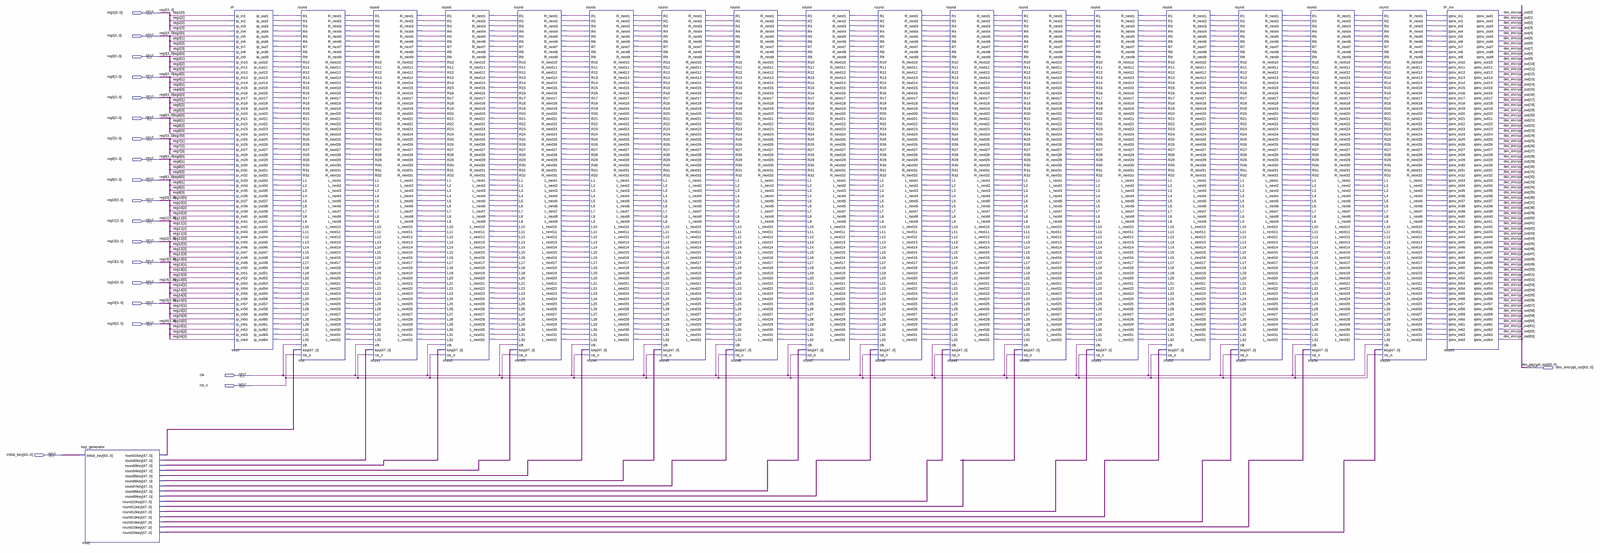
[diagram p0: schematic sheet, whole]
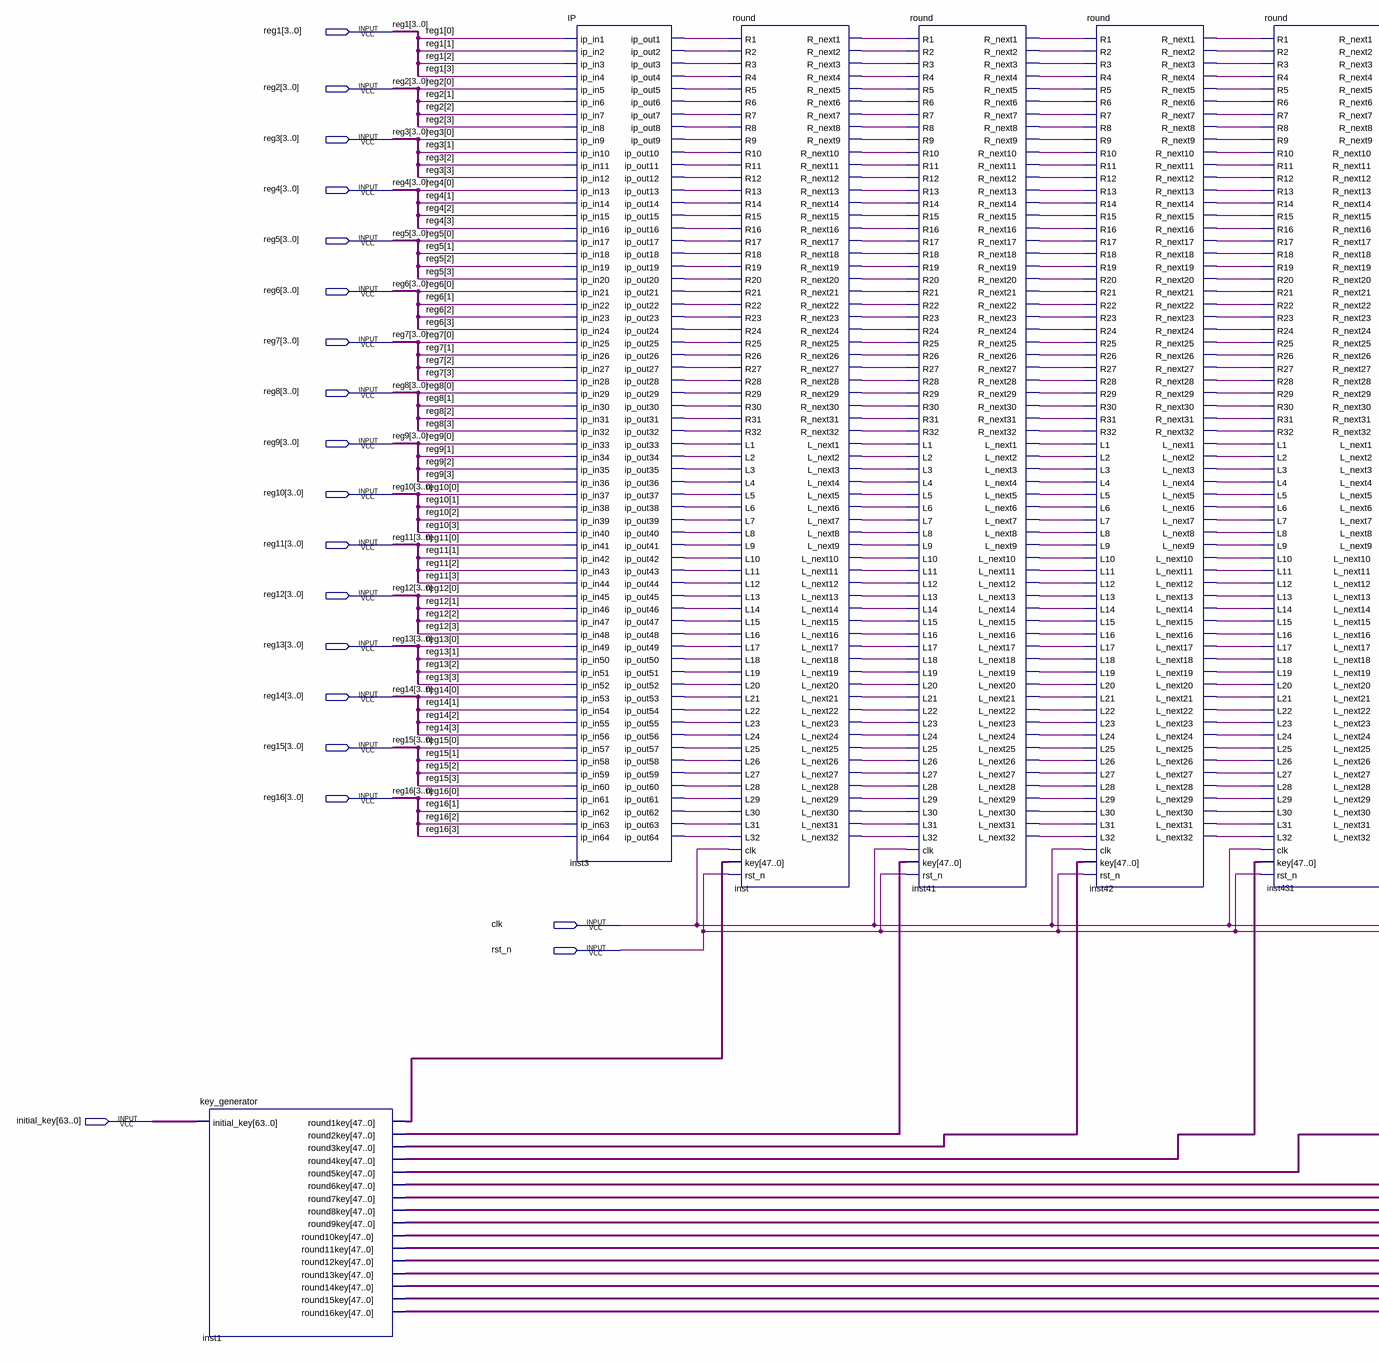
[diagram p1: schematic sheet, left part]
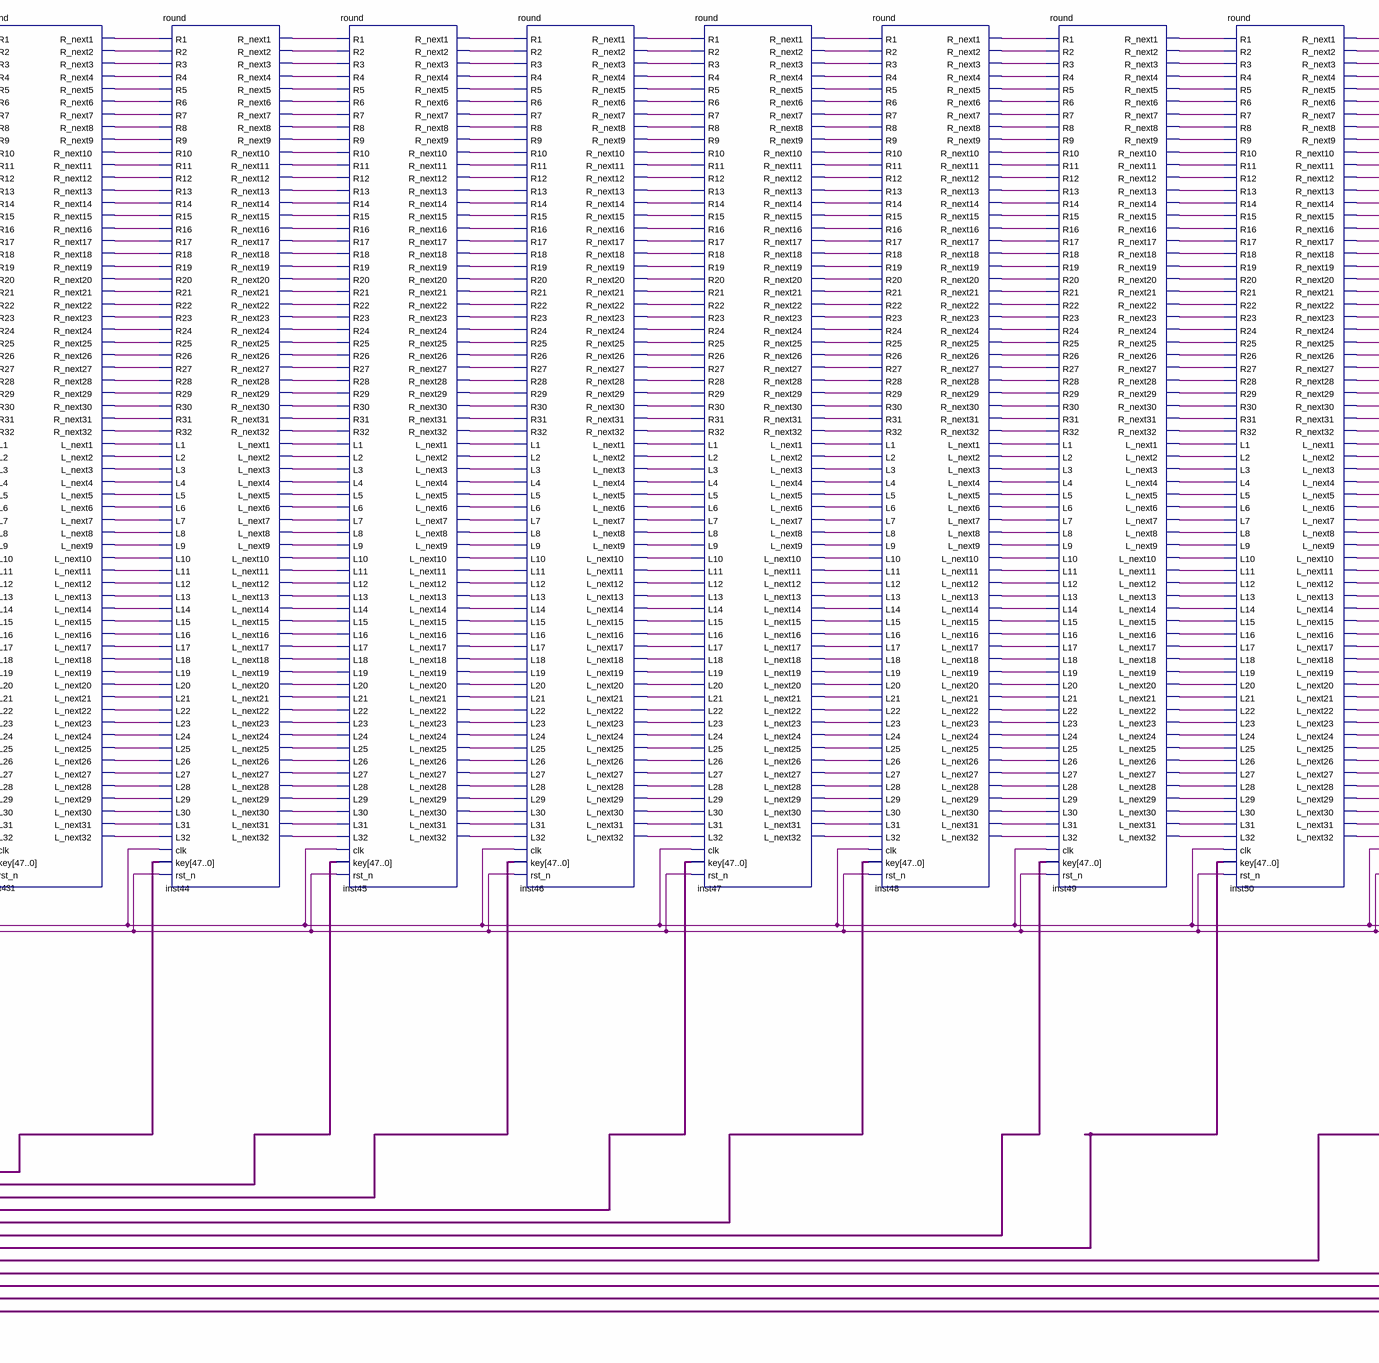
[diagram p2: schematic sheet, centre part]
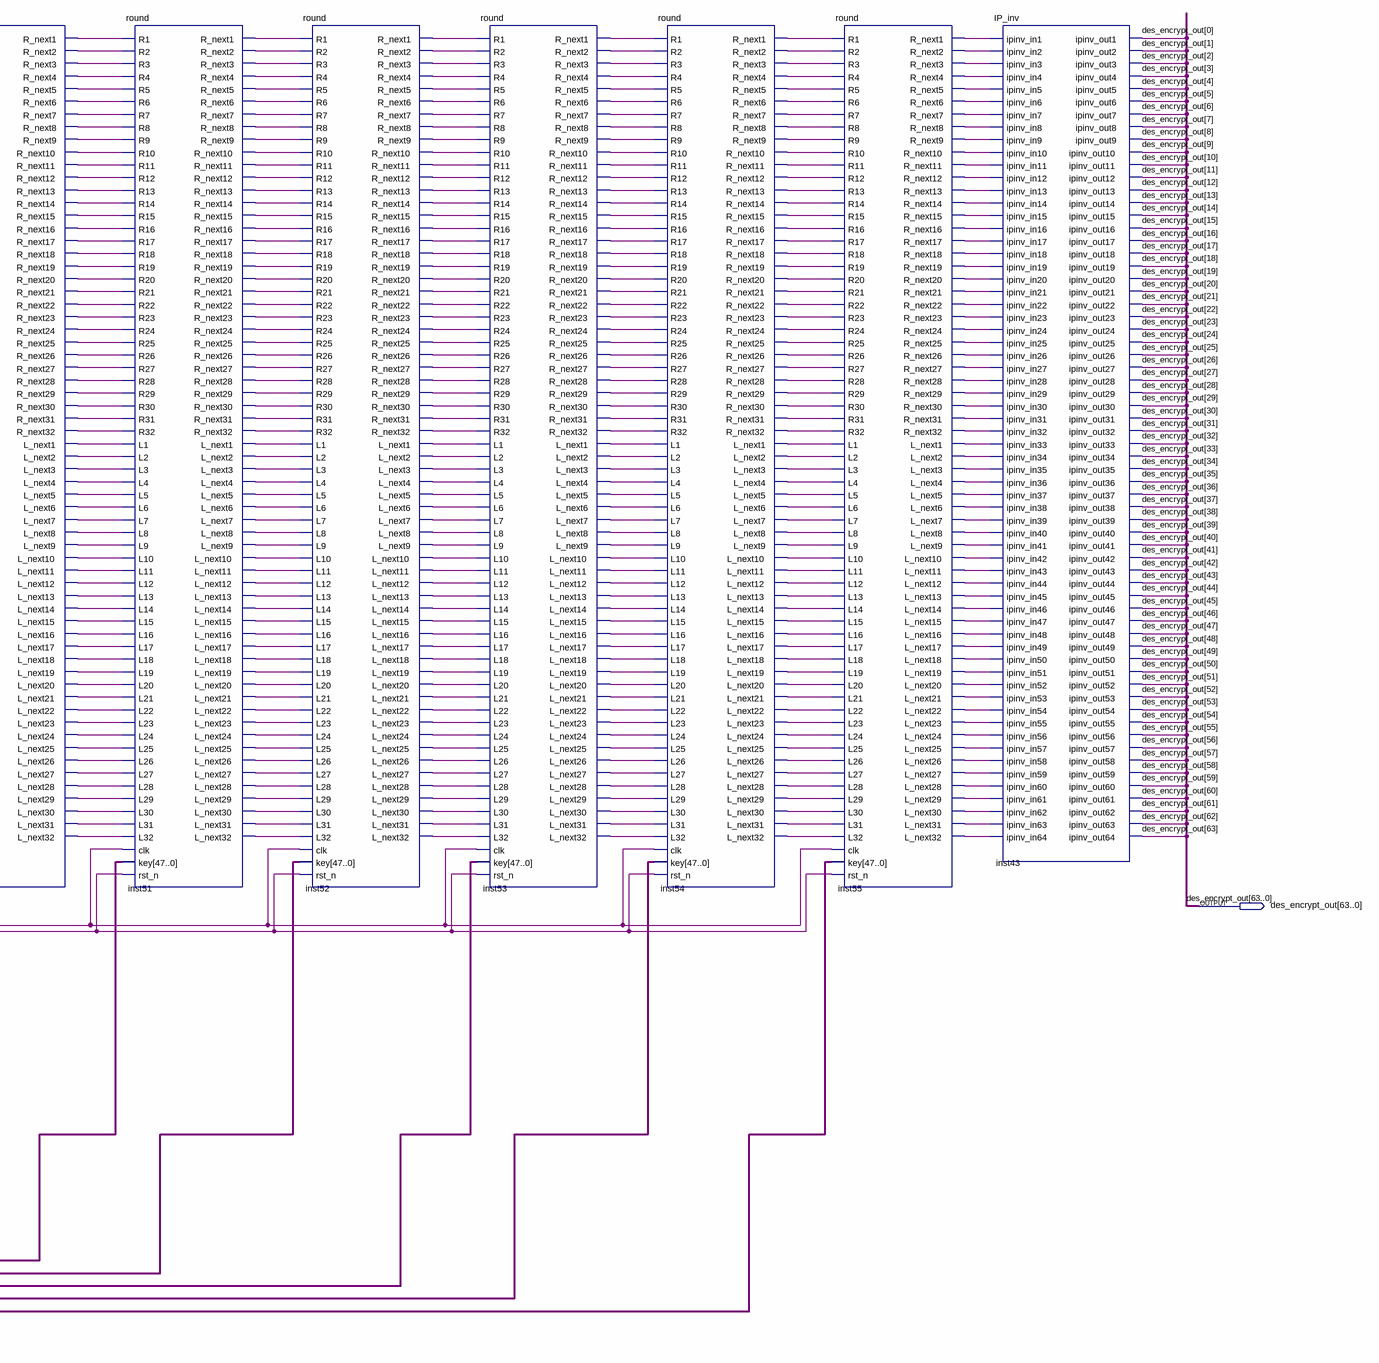
[diagram p3: schematic sheet, right part]
// Quartus schematic desencrypt.bdf as structural Verilog: 19 symbols, 20 pins
module desencrypt (
  input  [3:0] reg1,
  input  [3:0] reg2,
  input  [3:0] reg3,
  input  [3:0] reg4,
  input  [3:0] reg5,
  input  [3:0] reg6,
  input  [3:0] reg7,
  input  [3:0] reg8,
  input  [3:0] reg9,
  input  [3:0] reg10,
  input  [3:0] reg11,
  input  [3:0] reg12,
  input  [3:0] reg13,
  input  [3:0] reg14,
  input  [3:0] reg15,
  input  [3:0] reg16,
  input  clk,
  input  rst_n,
  input  [63:0] initial_key,
  output [63:0] des_encrypt_out
);

  wire inst3_ip_out1, inst3_ip_out2, inst3_ip_out3, inst3_ip_out4, inst3_ip_out5, inst3_ip_out6,
       inst3_ip_out7, inst3_ip_out8, inst3_ip_out9, inst3_ip_out10, inst3_ip_out11, inst3_ip_out12,
       inst3_ip_out13, inst3_ip_out14, inst3_ip_out15, inst3_ip_out16, inst3_ip_out17, inst3_ip_out18,
       inst3_ip_out19, inst3_ip_out20, inst3_ip_out21, inst3_ip_out22, inst3_ip_out23, inst3_ip_out24,
       inst3_ip_out25, inst3_ip_out26, inst3_ip_out27, inst3_ip_out28, inst3_ip_out29, inst3_ip_out30,
       inst3_ip_out31, inst3_ip_out32, inst3_ip_out33, inst3_ip_out34, inst3_ip_out35, inst3_ip_out36,
       inst3_ip_out37, inst3_ip_out38, inst3_ip_out39, inst3_ip_out40, inst3_ip_out41, inst3_ip_out42,
       inst3_ip_out43, inst3_ip_out44, inst3_ip_out45, inst3_ip_out46, inst3_ip_out47, inst3_ip_out48,
       inst3_ip_out49, inst3_ip_out50, inst3_ip_out51, inst3_ip_out52, inst3_ip_out53, inst3_ip_out54,
       inst3_ip_out55, inst3_ip_out56, inst3_ip_out57, inst3_ip_out58, inst3_ip_out59, inst3_ip_out60,
       inst3_ip_out61, inst3_ip_out62, inst3_ip_out63, inst3_ip_out64, inst41_l_next1, inst41_l_next2,
       inst41_l_next3, inst41_l_next4, inst41_l_next5, inst41_l_next6, inst41_l_next7, inst41_l_next8,
       inst41_l_next9, inst41_l_next10, inst41_l_next11, inst41_l_next12, inst41_l_next13, inst41_l_next14,
       inst41_l_next15, inst41_l_next16, inst41_l_next17, inst41_l_next18, inst41_l_next19, inst41_l_next20,
       inst41_l_next21, inst41_l_next22, inst41_l_next23, inst41_l_next24, inst41_l_next25, inst41_l_next26,
       inst41_l_next27, inst41_l_next28, inst41_l_next29, inst41_l_next30, inst41_l_next31, inst41_l_next32,
       inst41_r_next1, inst41_r_next2, inst41_r_next3, inst41_r_next4, inst41_r_next5, inst41_r_next6,
       inst41_r_next7, inst41_r_next8, inst41_r_next9, inst41_r_next10, inst41_r_next11, inst41_r_next12,
       inst41_r_next13, inst41_r_next14, inst41_r_next15, inst41_r_next16, inst41_r_next17, inst41_r_next18,
       inst41_r_next19, inst41_r_next20, inst41_r_next21, inst41_r_next22, inst41_r_next23, inst41_r_next24,
       inst41_r_next25, inst41_r_next26, inst41_r_next27, inst41_r_next28, inst41_r_next29, inst41_r_next30,
       inst41_r_next31, inst41_r_next32, inst42_l_next1, inst42_l_next2, inst42_l_next3, inst42_l_next4,
       inst42_l_next5, inst42_l_next6, inst42_l_next7, inst42_l_next8, inst42_l_next9, inst42_l_next10,
       inst42_l_next11, inst42_l_next12, inst42_l_next13, inst42_l_next14, inst42_l_next15, inst42_l_next16,
       inst42_l_next17, inst42_l_next18, inst42_l_next19, inst42_l_next20, inst42_l_next21, inst42_l_next22,
       inst42_l_next23, inst42_l_next24, inst42_l_next25, inst42_l_next26, inst42_l_next27, inst42_l_next28,
       inst42_l_next29, inst42_l_next30, inst42_l_next31, inst42_l_next32, inst42_r_next1, inst42_r_next2,
       inst42_r_next3, inst42_r_next4, inst42_r_next5, inst42_r_next6, inst42_r_next7, inst42_r_next8,
       inst42_r_next9, inst42_r_next10, inst42_r_next11, inst42_r_next12, inst42_r_next13, inst42_r_next14,
       inst42_r_next15, inst42_r_next16, inst42_r_next17, inst42_r_next18, inst42_r_next19, inst42_r_next20,
       inst42_r_next21, inst42_r_next22, inst42_r_next23, inst42_r_next24, inst42_r_next25, inst42_r_next26,
       inst42_r_next27, inst42_r_next28, inst42_r_next29, inst42_r_next30, inst42_r_next31, inst42_r_next32,
       inst44_l_next1, inst44_l_next2, inst44_l_next3, inst44_l_next4, inst44_l_next5, inst44_l_next6,
       inst44_l_next7, inst44_l_next8, inst44_l_next9, inst44_l_next10, inst44_l_next11, inst44_l_next12,
       inst44_l_next13, inst44_l_next14, inst44_l_next15, inst44_l_next16, inst44_l_next17, inst44_l_next18,
       inst44_l_next19, inst44_l_next20, inst44_l_next21, inst44_l_next22, inst44_l_next23, inst44_l_next24,
       inst44_l_next25, inst44_l_next26, inst44_l_next27, inst44_l_next28, inst44_l_next29, inst44_l_next30,
       inst44_l_next31, inst44_l_next32, inst44_r_next1, inst44_r_next2, inst44_r_next3, inst44_r_next4,
       inst44_r_next5, inst44_r_next6, inst44_r_next7, inst44_r_next8, inst44_r_next9, inst44_r_next10,
       inst44_r_next11, inst44_r_next12, inst44_r_next13, inst44_r_next14, inst44_r_next15, inst44_r_next16,
       inst44_r_next17, inst44_r_next18, inst44_r_next19, inst44_r_next20, inst44_r_next21, inst44_r_next22,
       inst44_r_next23, inst44_r_next24, inst44_r_next25, inst44_r_next26, inst44_r_next27, inst44_r_next28,
       inst44_r_next29, inst44_r_next30, inst44_r_next31, inst44_r_next32, inst45_l_next1, inst45_l_next2,
       inst45_l_next3, inst45_l_next4, inst45_l_next5, inst45_l_next6, inst45_l_next7, inst45_l_next8,
       inst45_l_next9, inst45_l_next10, inst45_l_next11, inst45_l_next12, inst45_l_next13, inst45_l_next14,
       inst45_l_next15, inst45_l_next16, inst45_l_next17, inst45_l_next18, inst45_l_next19, inst45_l_next20,
       inst45_l_next21, inst45_l_next22, inst45_l_next23, inst45_l_next24, inst45_l_next25, inst45_l_next26,
       inst45_l_next27, inst45_l_next28, inst45_l_next29, inst45_l_next30, inst45_l_next31, inst45_l_next32,
       inst45_r_next1, inst45_r_next2, inst45_r_next3, inst45_r_next4, inst45_r_next5, inst45_r_next6,
       inst45_r_next7, inst45_r_next8, inst45_r_next9, inst45_r_next10, inst45_r_next11, inst45_r_next12,
       inst45_r_next13, inst45_r_next14, inst45_r_next15, inst45_r_next16, inst45_r_next17, inst45_r_next18,
       inst45_r_next19, inst45_r_next20, inst45_r_next21, inst45_r_next22, inst45_r_next23, inst45_r_next24,
       inst45_r_next25, inst45_r_next26, inst45_r_next27, inst45_r_next28, inst45_r_next29, inst45_r_next30,
       inst45_r_next31, inst45_r_next32, inst46_l_next1, inst46_l_next2, inst46_l_next3, inst46_l_next4,
       inst46_l_next5, inst46_l_next6, inst46_l_next7, inst46_l_next8, inst46_l_next9, inst46_l_next10,
       inst46_l_next11, inst46_l_next12, inst46_l_next13, inst46_l_next14, inst46_l_next15, inst46_l_next16,
       inst46_l_next17, inst46_l_next18, inst46_l_next19, inst46_l_next20, inst46_l_next21, inst46_l_next22,
       inst46_l_next23, inst46_l_next24, inst46_l_next25, inst46_l_next26, inst46_l_next27, inst46_l_next28,
       inst46_l_next29, inst46_l_next30, inst46_l_next31, inst46_l_next32, inst46_r_next1, inst46_r_next2,
       inst46_r_next3, inst46_r_next4, inst46_r_next5, inst46_r_next6, inst46_r_next7, inst46_r_next8,
       inst46_r_next9, inst46_r_next10, inst46_r_next11, inst46_r_next12, inst46_r_next13, inst46_r_next14,
       inst46_r_next15, inst46_r_next16, inst46_r_next17, inst46_r_next18, inst46_r_next19, inst46_r_next20,
       inst46_r_next21, inst46_r_next22, inst46_r_next23, inst46_r_next24, inst46_r_next25, inst46_r_next26,
       inst46_r_next27, inst46_r_next28, inst46_r_next29, inst46_r_next30, inst46_r_next31, inst46_r_next32,
       inst47_l_next1, inst47_l_next2, inst47_l_next3, inst47_l_next4, inst47_l_next5, inst47_l_next6,
       inst47_l_next7, inst47_l_next8, inst47_l_next9, inst47_l_next10, inst47_l_next11, inst47_l_next12,
       inst47_l_next13, inst47_l_next14, inst47_l_next15, inst47_l_next16, inst47_l_next17, inst47_l_next18,
       inst47_l_next19, inst47_l_next20, inst47_l_next21, inst47_l_next22, inst47_l_next23, inst47_l_next24,
       inst47_l_next25, inst47_l_next26, inst47_l_next27, inst47_l_next28, inst47_l_next29, inst47_l_next30,
       inst47_l_next31, inst47_l_next32, inst47_r_next1, inst47_r_next2, inst47_r_next3, inst47_r_next4,
       inst47_r_next5, inst47_r_next6, inst47_r_next7, inst47_r_next8, inst47_r_next9, inst47_r_next10,
       inst47_r_next11, inst47_r_next12, inst47_r_next13, inst47_r_next14, inst47_r_next15, inst47_r_next16,
       inst47_r_next17, inst47_r_next18, inst47_r_next19, inst47_r_next20, inst47_r_next21, inst47_r_next22,
       inst47_r_next23, inst47_r_next24, inst47_r_next25, inst47_r_next26, inst47_r_next27, inst47_r_next28,
       inst47_r_next29, inst47_r_next30, inst47_r_next31, inst47_r_next32, inst48_l_next1, inst48_l_next2,
       inst48_l_next3, inst48_l_next4, inst48_l_next5, inst48_l_next6, inst48_l_next7, inst48_l_next8,
       inst48_l_next9, inst48_l_next10, inst48_l_next11, inst48_l_next12, inst48_l_next13, inst48_l_next14,
       inst48_l_next15, inst48_l_next16, inst48_l_next17, inst48_l_next18, inst48_l_next19, inst48_l_next20,
       inst48_l_next21, inst48_l_next22, inst48_l_next23, inst48_l_next24, inst48_l_next25, inst48_l_next26,
       inst48_l_next27, inst48_l_next28, inst48_l_next29, inst48_l_next30, inst48_l_next31, inst48_l_next32,
       inst48_r_next1, inst48_r_next2, inst48_r_next3, inst48_r_next4, inst48_r_next5, inst48_r_next6,
       inst48_r_next7, inst48_r_next8, inst48_r_next9, inst48_r_next10, inst48_r_next11, inst48_r_next12,
       inst48_r_next13, inst48_r_next14, inst48_r_next15, inst48_r_next16, inst48_r_next17, inst48_r_next18,
       inst48_r_next19, inst48_r_next20, inst48_r_next21, inst48_r_next22, inst48_r_next23, inst48_r_next24,
       inst48_r_next25, inst48_r_next26, inst48_r_next27, inst48_r_next28, inst48_r_next29, inst48_r_next30,
       inst48_r_next31, inst48_r_next32, inst49_l_next1, inst49_l_next2, inst49_l_next3, inst49_l_next4,
       inst49_l_next5, inst49_l_next6, inst49_l_next7, inst49_l_next8, inst49_l_next9, inst49_l_next10,
       inst49_l_next11, inst49_l_next12, inst49_l_next13, inst49_l_next14, inst49_l_next15, inst49_l_next16,
       inst49_l_next17, inst49_l_next18, inst49_l_next19, inst49_l_next20, inst49_l_next21, inst49_l_next22,
       inst49_l_next23, inst49_l_next24, inst49_l_next25, inst49_l_next26, inst49_l_next27, inst49_l_next28,
       inst49_l_next29, inst49_l_next30, inst49_l_next31, inst49_l_next32, inst49_r_next1, inst49_r_next2,
       inst49_r_next3, inst49_r_next4, inst49_r_next5, inst49_r_next6, inst49_r_next7, inst49_r_next8,
       inst49_r_next9, inst49_r_next10, inst49_r_next11, inst49_r_next12, inst49_r_next13, inst49_r_next14,
       inst49_r_next15, inst49_r_next16, inst49_r_next17, inst49_r_next18, inst49_r_next19, inst49_r_next20,
       inst49_r_next21, inst49_r_next22, inst49_r_next23, inst49_r_next24, inst49_r_next25, inst49_r_next26,
       inst49_r_next27, inst49_r_next28, inst49_r_next29, inst49_r_next30, inst49_r_next31, inst49_r_next32,
       inst50_l_next1, inst50_l_next2, inst50_l_next3, inst50_l_next4, inst50_l_next5, inst50_l_next6,
       inst50_l_next7, inst50_l_next8, inst50_l_next9, inst50_l_next10, inst50_l_next11, inst50_l_next12,
       inst50_l_next13, inst50_l_next14, inst50_l_next15, inst50_l_next16, inst50_l_next17, inst50_l_next18,
       inst50_l_next19, inst50_l_next20, inst50_l_next21, inst50_l_next22, inst50_l_next23, inst50_l_next24,
       inst50_l_next25, inst50_l_next26, inst50_l_next27, inst50_l_next28, inst50_l_next29, inst50_l_next30,
       inst50_l_next31, inst50_l_next32, inst50_r_next1, inst50_r_next2, inst50_r_next3, inst50_r_next4,
       inst50_r_next5, inst50_r_next6, inst50_r_next7, inst50_r_next8, inst50_r_next9, inst50_r_next10,
       inst50_r_next11, inst50_r_next12, inst50_r_next13, inst50_r_next14, inst50_r_next15, inst50_r_next16,
       inst50_r_next17, inst50_r_next18, inst50_r_next19, inst50_r_next20, inst50_r_next21, inst50_r_next22,
       inst50_r_next23, inst50_r_next24, inst50_r_next25, inst50_r_next26, inst50_r_next27, inst50_r_next28,
       inst50_r_next29, inst50_r_next30, inst50_r_next31, inst50_r_next32, inst51_l_next1, inst51_l_next2,
       inst51_l_next3, inst51_l_next4, inst51_l_next5, inst51_l_next6, inst51_l_next7, inst51_l_next8,
       inst51_l_next9, inst51_l_next10, inst51_l_next11, inst51_l_next12, inst51_l_next13, inst51_l_next14,
       inst51_l_next15, inst51_l_next16, inst51_l_next17, inst51_l_next18, inst51_l_next19, inst51_l_next20,
       inst51_l_next21, inst51_l_next22, inst51_l_next23, inst51_l_next24, inst51_l_next25, inst51_l_next26,
       inst51_l_next27, inst51_l_next28, inst51_l_next29, inst51_l_next30, inst51_l_next31, inst51_l_next32,
       inst51_r_next1, inst51_r_next2, inst51_r_next3, inst51_r_next4, inst51_r_next5, inst51_r_next6,
       inst51_r_next7, inst51_r_next8, inst51_r_next9, inst51_r_next10, inst51_r_next11, inst51_r_next12,
       inst51_r_next13, inst51_r_next14, inst51_r_next15, inst51_r_next16, inst51_r_next17, inst51_r_next18,
       inst51_r_next19, inst51_r_next20, inst51_r_next21, inst51_r_next22, inst51_r_next23, inst51_r_next24,
       inst51_r_next25, inst51_r_next26, inst51_r_next27, inst51_r_next28, inst51_r_next29, inst51_r_next30,
       inst51_r_next31, inst51_r_next32, inst52_l_next1, inst52_l_next2, inst52_l_next3, inst52_l_next4,
       inst52_l_next5, inst52_l_next6, inst52_l_next7, inst52_l_next8, inst52_l_next9, inst52_l_next10,
       inst52_l_next11, inst52_l_next12, inst52_l_next13, inst52_l_next14, inst52_l_next15, inst52_l_next16,
       inst52_l_next17, inst52_l_next18, inst52_l_next19, inst52_l_next20, inst52_l_next21, inst52_l_next22,
       inst52_l_next23, inst52_l_next24, inst52_l_next25, inst52_l_next26, inst52_l_next27, inst52_l_next28,
       inst52_l_next29, inst52_l_next30, inst52_l_next31, inst52_l_next32, inst52_r_next1, inst52_r_next2,
       inst52_r_next3, inst52_r_next4, inst52_r_next5, inst52_r_next6, inst52_r_next7, inst52_r_next8,
       inst52_r_next9, inst52_r_next10, inst52_r_next11, inst52_r_next12, inst52_r_next13, inst52_r_next14,
       inst52_r_next15, inst52_r_next16, inst52_r_next17, inst52_r_next18, inst52_r_next19, inst52_r_next20,
       inst52_r_next21, inst52_r_next22, inst52_r_next23, inst52_r_next24, inst52_r_next25, inst52_r_next26,
       inst52_r_next27, inst52_r_next28, inst52_r_next29, inst52_r_next30, inst52_r_next31, inst52_r_next32,
       inst53_l_next1, inst53_l_next2, inst53_l_next3, inst53_l_next4, inst53_l_next5, inst53_l_next6,
       inst53_l_next7, inst53_l_next8, inst53_l_next9, inst53_l_next10, inst53_l_next11, inst53_l_next12,
       inst53_l_next13, inst53_l_next14, inst53_l_next15, inst53_l_next16, inst53_l_next17, inst53_l_next18,
       inst53_l_next19, inst53_l_next20, inst53_l_next21, inst53_l_next22, inst53_l_next23, inst53_l_next24,
       inst53_l_next25, inst53_l_next26, inst53_l_next27, inst53_l_next28, inst53_l_next29, inst53_l_next30,
       inst53_l_next31, inst53_l_next32, inst53_r_next1, inst53_r_next2, inst53_r_next3, inst53_r_next4,
       inst53_r_next5, inst53_r_next6, inst53_r_next7, inst53_r_next8, inst53_r_next9, inst53_r_next10,
       inst53_r_next11, inst53_r_next12, inst53_r_next13, inst53_r_next14, inst53_r_next15, inst53_r_next16,
       inst53_r_next17, inst53_r_next18, inst53_r_next19, inst53_r_next20, inst53_r_next21, inst53_r_next22,
       inst53_r_next23, inst53_r_next24, inst53_r_next25, inst53_r_next26, inst53_r_next27, inst53_r_next28,
       inst53_r_next29, inst53_r_next30, inst53_r_next31, inst53_r_next32, inst54_l_next1, inst54_l_next2,
       inst54_l_next3, inst54_l_next4, inst54_l_next5, inst54_l_next6, inst54_l_next7, inst54_l_next8,
       inst54_l_next9, inst54_l_next10, inst54_l_next11, inst54_l_next12, inst54_l_next13, inst54_l_next14,
       inst54_l_next15, inst54_l_next16, inst54_l_next17, inst54_l_next18, inst54_l_next19, inst54_l_next20,
       inst54_l_next21, inst54_l_next22, inst54_l_next23, inst54_l_next24, inst54_l_next25, inst54_l_next26,
       inst54_l_next27, inst54_l_next28, inst54_l_next29, inst54_l_next30, inst54_l_next31, inst54_l_next32,
       inst54_r_next1, inst54_r_next2, inst54_r_next3, inst54_r_next4, inst54_r_next5, inst54_r_next6,
       inst54_r_next7, inst54_r_next8, inst54_r_next9, inst54_r_next10, inst54_r_next11, inst54_r_next12,
       inst54_r_next13, inst54_r_next14, inst54_r_next15, inst54_r_next16, inst54_r_next17, inst54_r_next18,
       inst54_r_next19, inst54_r_next20, inst54_r_next21, inst54_r_next22, inst54_r_next23, inst54_r_next24,
       inst54_r_next25, inst54_r_next26, inst54_r_next27, inst54_r_next28, inst54_r_next29, inst54_r_next30,
       inst54_r_next31, inst54_r_next32, inst55_l_next1, inst55_l_next2, inst55_l_next3, inst55_l_next4,
       inst55_l_next5, inst55_l_next6, inst55_l_next7, inst55_l_next8, inst55_l_next9, inst55_l_next10,
       inst55_l_next11, inst55_l_next12, inst55_l_next13, inst55_l_next14, inst55_l_next15, inst55_l_next16,
       inst55_l_next17, inst55_l_next18, inst55_l_next19, inst55_l_next20, inst55_l_next21, inst55_l_next22,
       inst55_l_next23, inst55_l_next24, inst55_l_next25, inst55_l_next26, inst55_l_next27, inst55_l_next28,
       inst55_l_next29, inst55_l_next30, inst55_l_next31, inst55_l_next32, inst55_r_next1, inst55_r_next2,
       inst55_r_next3, inst55_r_next4, inst55_r_next5, inst55_r_next6, inst55_r_next7, inst55_r_next8,
       inst55_r_next9, inst55_r_next10, inst55_r_next11, inst55_r_next12, inst55_r_next13, inst55_r_next14,
       inst55_r_next15, inst55_r_next16, inst55_r_next17, inst55_r_next18, inst55_r_next19, inst55_r_next20,
       inst55_r_next21, inst55_r_next22, inst55_r_next23, inst55_r_next24, inst55_r_next25, inst55_r_next26,
       inst55_r_next27, inst55_r_next28, inst55_r_next29, inst55_r_next30, inst55_r_next31, inst55_r_next32,
       inst431_l_next1, inst431_l_next2, inst431_l_next3, inst431_l_next4, inst431_l_next5, inst431_l_next6,
       inst431_l_next7, inst431_l_next8, inst431_l_next9, inst431_l_next10, inst431_l_next11,
       inst431_l_next12, inst431_l_next13, inst431_l_next14, inst431_l_next15, inst431_l_next16,
       inst431_l_next17, inst431_l_next18, inst431_l_next19, inst431_l_next20, inst431_l_next21,
       inst431_l_next22, inst431_l_next23, inst431_l_next24, inst431_l_next25, inst431_l_next26,
       inst431_l_next27, inst431_l_next28, inst431_l_next29, inst431_l_next30, inst431_l_next31,
       inst431_l_next32, inst431_r_next1, inst431_r_next2, inst431_r_next3, inst431_r_next4, inst431_r_next5,
       inst431_r_next6, inst431_r_next7, inst431_r_next8, inst431_r_next9, inst431_r_next10,
       inst431_r_next11, inst431_r_next12, inst431_r_next13, inst431_r_next14, inst431_r_next15,
       inst431_r_next16, inst431_r_next17, inst431_r_next18, inst431_r_next19, inst431_r_next20,
       inst431_r_next21, inst431_r_next22, inst431_r_next23, inst431_r_next24, inst431_r_next25,
       inst431_r_next26, inst431_r_next27, inst431_r_next28, inst431_r_next29, inst431_r_next30,
       inst431_r_next31, inst431_r_next32, inst_l_next1, inst_l_next2, inst_l_next3, inst_l_next4,
       inst_l_next5, inst_l_next6, inst_l_next7, inst_l_next8, inst_l_next9, inst_l_next10, inst_l_next11,
       inst_l_next12, inst_l_next13, inst_l_next14, inst_l_next15, inst_l_next16, inst_l_next17,
       inst_l_next18, inst_l_next19, inst_l_next20, inst_l_next21, inst_l_next22, inst_l_next23,
       inst_l_next24, inst_l_next25, inst_l_next26, inst_l_next27, inst_l_next28, inst_l_next29,
       inst_l_next30, inst_l_next31, inst_l_next32, inst_r_next1, inst_r_next2, inst_r_next3, inst_r_next4,
       inst_r_next5, inst_r_next6, inst_r_next7, inst_r_next8, inst_r_next9, inst_r_next10, inst_r_next11,
       inst_r_next12, inst_r_next13, inst_r_next14, inst_r_next15, inst_r_next16, inst_r_next17,
       inst_r_next18, inst_r_next19, inst_r_next20, inst_r_next21, inst_r_next22, inst_r_next23,
       inst_r_next24, inst_r_next25, inst_r_next26, inst_r_next27, inst_r_next28, inst_r_next29,
       inst_r_next30, inst_r_next31, inst_r_next32;
  wire [47:0] inst1_round1key, inst1_round2key, inst1_round3key, inst1_round4key, inst1_round5key,
       inst1_round6key, inst1_round7key, inst1_round8key, inst1_round9key, inst1_round10key,
       inst1_round11key, inst1_round12key, inst1_round13key, inst1_round14key, inst1_round15key,
       inst1_round16key;

  key_generator inst1 (
    .initial_key(initial_key), .round1key(inst1_round1key), .round2key(inst1_round2key),
    .round3key(inst1_round3key), .round4key(inst1_round4key), .round5key(inst1_round5key),
    .round6key(inst1_round6key), .round7key(inst1_round7key), .round8key(inst1_round8key),
    .round9key(inst1_round9key), .round10key(inst1_round10key), .round11key(inst1_round11key),
    .round12key(inst1_round12key), .round13key(inst1_round13key), .round14key(inst1_round14key),
    .round15key(inst1_round15key), .round16key(inst1_round16key));
  IP inst3 (
    .ip_in1(reg1[0]), .ip_in2(reg1[1]), .ip_in3(reg1[2]), .ip_in4(reg1[3]), .ip_in5(reg2[0]),
    .ip_in6(reg2[1]), .ip_in7(reg2[2]), .ip_in8(reg2[3]), .ip_in9(reg3[0]), .ip_in10(reg3[1]),
    .ip_in11(reg3[2]), .ip_in12(reg3[3]), .ip_in13(reg4[0]), .ip_in14(reg4[1]), .ip_in15(reg4[2]),
    .ip_in16(reg4[3]), .ip_in17(reg5[0]), .ip_in18(reg5[1]), .ip_in19(reg5[2]), .ip_in20(reg5[3]),
    .ip_in21(reg6[0]), .ip_in22(reg6[1]), .ip_in23(reg6[2]), .ip_in24(reg6[3]), .ip_in25(reg7[0]),
    .ip_in26(reg7[1]), .ip_in27(reg7[2]), .ip_in28(reg7[3]), .ip_in29(reg8[0]), .ip_in30(reg8[1]),
    .ip_in31(reg8[2]), .ip_in32(reg8[3]), .ip_in33(reg9[0]), .ip_in34(reg9[1]), .ip_in35(reg9[2]),
    .ip_in36(reg9[3]), .ip_in37(reg10[0]), .ip_in38(reg10[1]), .ip_in39(reg10[2]), .ip_in40(reg10[3]),
    .ip_in41(reg11[0]), .ip_in42(reg11[1]), .ip_in43(reg11[2]), .ip_in44(reg11[3]), .ip_in45(reg12[0]),
    .ip_in46(reg12[1]), .ip_in47(reg12[2]), .ip_in48(reg12[3]), .ip_in49(reg13[0]), .ip_in50(reg13[1]),
    .ip_in51(reg13[2]), .ip_in52(reg13[3]), .ip_in53(reg14[0]), .ip_in54(reg14[1]), .ip_in55(reg14[2]),
    .ip_in56(reg14[3]), .ip_in57(reg15[0]), .ip_in58(reg15[1]), .ip_in59(reg15[2]), .ip_in60(reg15[3]),
    .ip_in61(reg16[0]), .ip_in62(reg16[1]), .ip_in63(reg16[2]), .ip_in64(reg16[3]), .ip_out1(inst3_ip_out1),
    .ip_out2(inst3_ip_out2), .ip_out3(inst3_ip_out3), .ip_out4(inst3_ip_out4), .ip_out5(inst3_ip_out5),
    .ip_out6(inst3_ip_out6), .ip_out7(inst3_ip_out7), .ip_out8(inst3_ip_out8), .ip_out9(inst3_ip_out9),
    .ip_out10(inst3_ip_out10), .ip_out11(inst3_ip_out11), .ip_out12(inst3_ip_out12),
    .ip_out13(inst3_ip_out13), .ip_out14(inst3_ip_out14), .ip_out15(inst3_ip_out15),
    .ip_out16(inst3_ip_out16), .ip_out17(inst3_ip_out17), .ip_out18(inst3_ip_out18),
    .ip_out19(inst3_ip_out19), .ip_out20(inst3_ip_out20), .ip_out21(inst3_ip_out21),
    .ip_out22(inst3_ip_out22), .ip_out23(inst3_ip_out23), .ip_out24(inst3_ip_out24),
    .ip_out25(inst3_ip_out25), .ip_out26(inst3_ip_out26), .ip_out27(inst3_ip_out27),
    .ip_out28(inst3_ip_out28), .ip_out29(inst3_ip_out29), .ip_out30(inst3_ip_out30),
    .ip_out31(inst3_ip_out31), .ip_out32(inst3_ip_out32), .ip_out33(inst3_ip_out33),
    .ip_out34(inst3_ip_out34), .ip_out35(inst3_ip_out35), .ip_out36(inst3_ip_out36),
    .ip_out37(inst3_ip_out37), .ip_out38(inst3_ip_out38), .ip_out39(inst3_ip_out39),
    .ip_out40(inst3_ip_out40), .ip_out41(inst3_ip_out41), .ip_out42(inst3_ip_out42),
    .ip_out43(inst3_ip_out43), .ip_out44(inst3_ip_out44), .ip_out45(inst3_ip_out45),
    .ip_out46(inst3_ip_out46), .ip_out47(inst3_ip_out47), .ip_out48(inst3_ip_out48),
    .ip_out49(inst3_ip_out49), .ip_out50(inst3_ip_out50), .ip_out51(inst3_ip_out51),
    .ip_out52(inst3_ip_out52), .ip_out53(inst3_ip_out53), .ip_out54(inst3_ip_out54),
    .ip_out55(inst3_ip_out55), .ip_out56(inst3_ip_out56), .ip_out57(inst3_ip_out57),
    .ip_out58(inst3_ip_out58), .ip_out59(inst3_ip_out59), .ip_out60(inst3_ip_out60),
    .ip_out61(inst3_ip_out61), .ip_out62(inst3_ip_out62), .ip_out63(inst3_ip_out63), .ip_out64(inst3_ip_out64));
  round inst (
    .R1(inst3_ip_out1), .R2(inst3_ip_out2), .R3(inst3_ip_out3), .R4(inst3_ip_out4), .R5(inst3_ip_out5),
    .R6(inst3_ip_out6), .R7(inst3_ip_out7), .R8(inst3_ip_out8), .R9(inst3_ip_out9), .R10(inst3_ip_out10),
    .R11(inst3_ip_out11), .R12(inst3_ip_out12), .R13(inst3_ip_out13), .R14(inst3_ip_out14),
    .R15(inst3_ip_out15), .R16(inst3_ip_out16), .R17(inst3_ip_out17), .R18(inst3_ip_out18),
    .R19(inst3_ip_out19), .R20(inst3_ip_out20), .R21(inst3_ip_out21), .R22(inst3_ip_out22),
    .R23(inst3_ip_out23), .R24(inst3_ip_out24), .R25(inst3_ip_out25), .R26(inst3_ip_out26),
    .R27(inst3_ip_out27), .R28(inst3_ip_out28), .R29(inst3_ip_out29), .R30(inst3_ip_out30),
    .R31(inst3_ip_out31), .R32(inst3_ip_out32), .L1(inst3_ip_out33), .L2(inst3_ip_out34),
    .L3(inst3_ip_out35), .L4(inst3_ip_out36), .L5(inst3_ip_out37), .L6(inst3_ip_out38), .L7(inst3_ip_out39),
    .L8(inst3_ip_out40), .L9(inst3_ip_out41), .L10(inst3_ip_out42), .L11(inst3_ip_out43),
    .L12(inst3_ip_out44), .L13(inst3_ip_out45), .L14(inst3_ip_out46), .L15(inst3_ip_out47),
    .L16(inst3_ip_out48), .L17(inst3_ip_out49), .L18(inst3_ip_out50), .L19(inst3_ip_out51),
    .L20(inst3_ip_out52), .L21(inst3_ip_out53), .L22(inst3_ip_out54), .L23(inst3_ip_out55),
    .L24(inst3_ip_out56), .L25(inst3_ip_out57), .L26(inst3_ip_out58), .L27(inst3_ip_out59),
    .L28(inst3_ip_out60), .L29(inst3_ip_out61), .L30(inst3_ip_out62), .L31(inst3_ip_out63),
    .L32(inst3_ip_out64), .clk(clk), .key(inst1_round1key), .rst_n(rst_n), .R_next1(inst_r_next1),
    .R_next2(inst_r_next2), .R_next3(inst_r_next3), .R_next4(inst_r_next4), .R_next5(inst_r_next5),
    .R_next6(inst_r_next6), .R_next7(inst_r_next7), .R_next8(inst_r_next8), .R_next9(inst_r_next9),
    .R_next10(inst_r_next10), .R_next11(inst_r_next11), .R_next12(inst_r_next12), .R_next13(inst_r_next13),
    .R_next14(inst_r_next14), .R_next15(inst_r_next15), .R_next16(inst_r_next16), .R_next17(inst_r_next17),
    .R_next18(inst_r_next18), .R_next19(inst_r_next19), .R_next20(inst_r_next20), .R_next21(inst_r_next21),
    .R_next22(inst_r_next22), .R_next23(inst_r_next23), .R_next24(inst_r_next24), .R_next25(inst_r_next25),
    .R_next26(inst_r_next26), .R_next27(inst_r_next27), .R_next28(inst_r_next28), .R_next29(inst_r_next29),
    .R_next30(inst_r_next30), .R_next31(inst_r_next31), .R_next32(inst_r_next32), .L_next1(inst_l_next1),
    .L_next2(inst_l_next2), .L_next3(inst_l_next3), .L_next4(inst_l_next4), .L_next5(inst_l_next5),
    .L_next6(inst_l_next6), .L_next7(inst_l_next7), .L_next8(inst_l_next8), .L_next9(inst_l_next9),
    .L_next10(inst_l_next10), .L_next11(inst_l_next11), .L_next12(inst_l_next12), .L_next13(inst_l_next13),
    .L_next14(inst_l_next14), .L_next15(inst_l_next15), .L_next16(inst_l_next16), .L_next17(inst_l_next17),
    .L_next18(inst_l_next18), .L_next19(inst_l_next19), .L_next20(inst_l_next20), .L_next21(inst_l_next21),
    .L_next22(inst_l_next22), .L_next23(inst_l_next23), .L_next24(inst_l_next24), .L_next25(inst_l_next25),
    .L_next26(inst_l_next26), .L_next27(inst_l_next27), .L_next28(inst_l_next28), .L_next29(inst_l_next29),
    .L_next30(inst_l_next30), .L_next31(inst_l_next31), .L_next32(inst_l_next32));
  round inst41 (
    .R1(inst_r_next1), .R2(inst_r_next2), .R3(inst_r_next3), .R4(inst_r_next4), .R5(inst_r_next5),
    .R6(inst_r_next6), .R7(inst_r_next7), .R8(inst_r_next8), .R9(inst_r_next9), .R10(inst_r_next10),
    .R11(inst_r_next11), .R12(inst_r_next12), .R13(inst_r_next13), .R14(inst_r_next14), .R15(inst_r_next15),
    .R16(inst_r_next16), .R17(inst_r_next17), .R18(inst_r_next18), .R19(inst_r_next19), .R20(inst_r_next20),
    .R21(inst_r_next21), .R22(inst_r_next22), .R23(inst_r_next23), .R24(inst_r_next24), .R25(inst_r_next25),
    .R26(inst_r_next26), .R27(inst_r_next27), .R28(inst_r_next28), .R29(inst_r_next29), .R30(inst_r_next30),
    .R31(inst_r_next31), .R32(inst_r_next32), .L1(inst_l_next1), .L2(inst_l_next2), .L3(inst_l_next3),
    .L4(inst_l_next4), .L5(inst_l_next5), .L6(inst_l_next6), .L7(inst_l_next7), .L8(inst_l_next8),
    .L9(inst_l_next9), .L10(inst_l_next10), .L11(inst_l_next11), .L12(inst_l_next12), .L13(inst_l_next13),
    .L14(inst_l_next14), .L15(inst_l_next15), .L16(inst_l_next16), .L17(inst_l_next17), .L18(inst_l_next18),
    .L19(inst_l_next19), .L20(inst_l_next20), .L21(inst_l_next21), .L22(inst_l_next22), .L23(inst_l_next23),
    .L24(inst_l_next24), .L25(inst_l_next25), .L26(inst_l_next26), .L27(inst_l_next27), .L28(inst_l_next28),
    .L29(inst_l_next29), .L30(inst_l_next30), .L31(inst_l_next31), .L32(inst_l_next32), .clk(clk),
    .key(inst1_round2key), .rst_n(rst_n), .R_next1(inst41_r_next1), .R_next2(inst41_r_next2),
    .R_next3(inst41_r_next3), .R_next4(inst41_r_next4), .R_next5(inst41_r_next5), .R_next6(inst41_r_next6),
    .R_next7(inst41_r_next7), .R_next8(inst41_r_next8), .R_next9(inst41_r_next9), .R_next10(inst41_r_next10),
    .R_next11(inst41_r_next11), .R_next12(inst41_r_next12), .R_next13(inst41_r_next13),
    .R_next14(inst41_r_next14), .R_next15(inst41_r_next15), .R_next16(inst41_r_next16),
    .R_next17(inst41_r_next17), .R_next18(inst41_r_next18), .R_next19(inst41_r_next19),
    .R_next20(inst41_r_next20), .R_next21(inst41_r_next21), .R_next22(inst41_r_next22),
    .R_next23(inst41_r_next23), .R_next24(inst41_r_next24), .R_next25(inst41_r_next25),
    .R_next26(inst41_r_next26), .R_next27(inst41_r_next27), .R_next28(inst41_r_next28),
    .R_next29(inst41_r_next29), .R_next30(inst41_r_next30), .R_next31(inst41_r_next31),
    .R_next32(inst41_r_next32), .L_next1(inst41_l_next1), .L_next2(inst41_l_next2), .L_next3(inst41_l_next3),
    .L_next4(inst41_l_next4), .L_next5(inst41_l_next5), .L_next6(inst41_l_next6), .L_next7(inst41_l_next7),
    .L_next8(inst41_l_next8), .L_next9(inst41_l_next9), .L_next10(inst41_l_next10),
    .L_next11(inst41_l_next11), .L_next12(inst41_l_next12), .L_next13(inst41_l_next13),
    .L_next14(inst41_l_next14), .L_next15(inst41_l_next15), .L_next16(inst41_l_next16),
    .L_next17(inst41_l_next17), .L_next18(inst41_l_next18), .L_next19(inst41_l_next19),
    .L_next20(inst41_l_next20), .L_next21(inst41_l_next21), .L_next22(inst41_l_next22),
    .L_next23(inst41_l_next23), .L_next24(inst41_l_next24), .L_next25(inst41_l_next25),
    .L_next26(inst41_l_next26), .L_next27(inst41_l_next27), .L_next28(inst41_l_next28),
    .L_next29(inst41_l_next29), .L_next30(inst41_l_next30), .L_next31(inst41_l_next31),
    .L_next32(inst41_l_next32));
  round inst42 (
    .R1(inst41_r_next1), .R2(inst41_r_next2), .R3(inst41_r_next3), .R4(inst41_r_next4), .R5(inst41_r_next5),
    .R6(inst41_r_next6), .R7(inst41_r_next7), .R8(inst41_r_next8), .R9(inst41_r_next9),
    .R10(inst41_r_next10), .R11(inst41_r_next11), .R12(inst41_r_next12), .R13(inst41_r_next13),
    .R14(inst41_r_next14), .R15(inst41_r_next15), .R16(inst41_r_next16), .R17(inst41_r_next17),
    .R18(inst41_r_next18), .R19(inst41_r_next19), .R20(inst41_r_next20), .R21(inst41_r_next21),
    .R22(inst41_r_next22), .R23(inst41_r_next23), .R24(inst41_r_next24), .R25(inst41_r_next25),
    .R26(inst41_r_next26), .R27(inst41_r_next27), .R28(inst41_r_next28), .R29(inst41_r_next29),
    .R30(inst41_r_next30), .R31(inst41_r_next31), .R32(inst41_r_next32), .L1(inst41_l_next1),
    .L2(inst41_l_next2), .L3(inst41_l_next3), .L4(inst41_l_next4), .L5(inst41_l_next5), .L6(inst41_l_next6),
    .L7(inst41_l_next7), .L8(inst41_l_next8), .L9(inst41_l_next9), .L10(inst41_l_next10),
    .L11(inst41_l_next11), .L12(inst41_l_next12), .L13(inst41_l_next13), .L14(inst41_l_next14),
    .L15(inst41_l_next15), .L16(inst41_l_next16), .L17(inst41_l_next17), .L18(inst41_l_next18),
    .L19(inst41_l_next19), .L20(inst41_l_next20), .L21(inst41_l_next21), .L22(inst41_l_next22),
    .L23(inst41_l_next23), .L24(inst41_l_next24), .L25(inst41_l_next25), .L26(inst41_l_next26),
    .L27(inst41_l_next27), .L28(inst41_l_next28), .L29(inst41_l_next29), .L30(inst41_l_next30),
    .L31(inst41_l_next31), .L32(inst41_l_next32), .clk(clk), .key(inst1_round3key), .rst_n(rst_n),
    .R_next1(inst42_r_next1), .R_next2(inst42_r_next2), .R_next3(inst42_r_next3), .R_next4(inst42_r_next4),
    .R_next5(inst42_r_next5), .R_next6(inst42_r_next6), .R_next7(inst42_r_next7), .R_next8(inst42_r_next8),
    .R_next9(inst42_r_next9), .R_next10(inst42_r_next10), .R_next11(inst42_r_next11),
    .R_next12(inst42_r_next12), .R_next13(inst42_r_next13), .R_next14(inst42_r_next14),
    .R_next15(inst42_r_next15), .R_next16(inst42_r_next16), .R_next17(inst42_r_next17),
    .R_next18(inst42_r_next18), .R_next19(inst42_r_next19), .R_next20(inst42_r_next20),
    .R_next21(inst42_r_next21), .R_next22(inst42_r_next22), .R_next23(inst42_r_next23),
    .R_next24(inst42_r_next24), .R_next25(inst42_r_next25), .R_next26(inst42_r_next26),
    .R_next27(inst42_r_next27), .R_next28(inst42_r_next28), .R_next29(inst42_r_next29),
    .R_next30(inst42_r_next30), .R_next31(inst42_r_next31), .R_next32(inst42_r_next32),
    .L_next1(inst42_l_next1), .L_next2(inst42_l_next2), .L_next3(inst42_l_next3), .L_next4(inst42_l_next4),
    .L_next5(inst42_l_next5), .L_next6(inst42_l_next6), .L_next7(inst42_l_next7), .L_next8(inst42_l_next8),
    .L_next9(inst42_l_next9), .L_next10(inst42_l_next10), .L_next11(inst42_l_next11),
    .L_next12(inst42_l_next12), .L_next13(inst42_l_next13), .L_next14(inst42_l_next14),
    .L_next15(inst42_l_next15), .L_next16(inst42_l_next16), .L_next17(inst42_l_next17),
    .L_next18(inst42_l_next18), .L_next19(inst42_l_next19), .L_next20(inst42_l_next20),
    .L_next21(inst42_l_next21), .L_next22(inst42_l_next22), .L_next23(inst42_l_next23),
    .L_next24(inst42_l_next24), .L_next25(inst42_l_next25), .L_next26(inst42_l_next26),
    .L_next27(inst42_l_next27), .L_next28(inst42_l_next28), .L_next29(inst42_l_next29),
    .L_next30(inst42_l_next30), .L_next31(inst42_l_next31), .L_next32(inst42_l_next32));
  round inst431 (
    .R1(inst42_r_next1), .R2(inst42_r_next2), .R3(inst42_r_next3), .R4(inst42_r_next4), .R5(inst42_r_next5),
    .R6(inst42_r_next6), .R7(inst42_r_next7), .R8(inst42_r_next8), .R9(inst42_r_next9),
    .R10(inst42_r_next10), .R11(inst42_r_next11), .R12(inst42_r_next12), .R13(inst42_r_next13),
    .R14(inst42_r_next14), .R15(inst42_r_next15), .R16(inst42_r_next16), .R17(inst42_r_next17),
    .R18(inst42_r_next18), .R19(inst42_r_next19), .R20(inst42_r_next20), .R21(inst42_r_next21),
    .R22(inst42_r_next22), .R23(inst42_r_next23), .R24(inst42_r_next24), .R25(inst42_r_next25),
    .R26(inst42_r_next26), .R27(inst42_r_next27), .R28(inst42_r_next28), .R29(inst42_r_next29),
    .R30(inst42_r_next30), .R31(inst42_r_next31), .R32(inst42_r_next32), .L1(inst42_l_next1),
    .L2(inst42_l_next2), .L3(inst42_l_next3), .L4(inst42_l_next4), .L5(inst42_l_next5), .L6(inst42_l_next6),
    .L7(inst42_l_next7), .L8(inst42_l_next8), .L9(inst42_l_next9), .L10(inst42_l_next10),
    .L11(inst42_l_next11), .L12(inst42_l_next12), .L13(inst42_l_next13), .L14(inst42_l_next14),
    .L15(inst42_l_next15), .L16(inst42_l_next16), .L17(inst42_l_next17), .L18(inst42_l_next18),
    .L19(inst42_l_next19), .L20(inst42_l_next20), .L21(inst42_l_next21), .L22(inst42_l_next22),
    .L23(inst42_l_next23), .L24(inst42_l_next24), .L25(inst42_l_next25), .L26(inst42_l_next26),
    .L27(inst42_l_next27), .L28(inst42_l_next28), .L29(inst42_l_next29), .L30(inst42_l_next30),
    .L31(inst42_l_next31), .L32(inst42_l_next32), .clk(clk), .key(inst1_round4key), .rst_n(rst_n),
    .R_next1(inst431_r_next1), .R_next2(inst431_r_next2), .R_next3(inst431_r_next3),
    .R_next4(inst431_r_next4), .R_next5(inst431_r_next5), .R_next6(inst431_r_next6),
    .R_next7(inst431_r_next7), .R_next8(inst431_r_next8), .R_next9(inst431_r_next9),
    .R_next10(inst431_r_next10), .R_next11(inst431_r_next11), .R_next12(inst431_r_next12),
    .R_next13(inst431_r_next13), .R_next14(inst431_r_next14), .R_next15(inst431_r_next15),
    .R_next16(inst431_r_next16), .R_next17(inst431_r_next17), .R_next18(inst431_r_next18),
    .R_next19(inst431_r_next19), .R_next20(inst431_r_next20), .R_next21(inst431_r_next21),
    .R_next22(inst431_r_next22), .R_next23(inst431_r_next23), .R_next24(inst431_r_next24),
    .R_next25(inst431_r_next25), .R_next26(inst431_r_next26), .R_next27(inst431_r_next27),
    .R_next28(inst431_r_next28), .R_next29(inst431_r_next29), .R_next30(inst431_r_next30),
    .R_next31(inst431_r_next31), .R_next32(inst431_r_next32), .L_next1(inst431_l_next1),
    .L_next2(inst431_l_next2), .L_next3(inst431_l_next3), .L_next4(inst431_l_next4),
    .L_next5(inst431_l_next5), .L_next6(inst431_l_next6), .L_next7(inst431_l_next7),
    .L_next8(inst431_l_next8), .L_next9(inst431_l_next9), .L_next10(inst431_l_next10),
    .L_next11(inst431_l_next11), .L_next12(inst431_l_next12), .L_next13(inst431_l_next13),
    .L_next14(inst431_l_next14), .L_next15(inst431_l_next15), .L_next16(inst431_l_next16),
    .L_next17(inst431_l_next17), .L_next18(inst431_l_next18), .L_next19(inst431_l_next19),
    .L_next20(inst431_l_next20), .L_next21(inst431_l_next21), .L_next22(inst431_l_next22),
    .L_next23(inst431_l_next23), .L_next24(inst431_l_next24), .L_next25(inst431_l_next25),
    .L_next26(inst431_l_next26), .L_next27(inst431_l_next27), .L_next28(inst431_l_next28),
    .L_next29(inst431_l_next29), .L_next30(inst431_l_next30), .L_next31(inst431_l_next31),
    .L_next32(inst431_l_next32));
  round inst44 (
    .R1(inst431_r_next1), .R2(inst431_r_next2), .R3(inst431_r_next3), .R4(inst431_r_next4),
    .R5(inst431_r_next5), .R6(inst431_r_next6), .R7(inst431_r_next7), .R8(inst431_r_next8),
    .R9(inst431_r_next9), .R10(inst431_r_next10), .R11(inst431_r_next11), .R12(inst431_r_next12),
    .R13(inst431_r_next13), .R14(inst431_r_next14), .R15(inst431_r_next15), .R16(inst431_r_next16),
    .R17(inst431_r_next17), .R18(inst431_r_next18), .R19(inst431_r_next19), .R20(inst431_r_next20),
    .R21(inst431_r_next21), .R22(inst431_r_next22), .R23(inst431_r_next23), .R24(inst431_r_next24),
    .R25(inst431_r_next25), .R26(inst431_r_next26), .R27(inst431_r_next27), .R28(inst431_r_next28),
    .R29(inst431_r_next29), .R30(inst431_r_next30), .R31(inst431_r_next31), .R32(inst431_r_next32),
    .L1(inst431_l_next1), .L2(inst431_l_next2), .L3(inst431_l_next3), .L4(inst431_l_next4),
    .L5(inst431_l_next5), .L6(inst431_l_next6), .L7(inst431_l_next7), .L8(inst431_l_next8),
    .L9(inst431_l_next9), .L10(inst431_l_next10), .L11(inst431_l_next11), .L12(inst431_l_next12),
    .L13(inst431_l_next13), .L14(inst431_l_next14), .L15(inst431_l_next15), .L16(inst431_l_next16),
    .L17(inst431_l_next17), .L18(inst431_l_next18), .L19(inst431_l_next19), .L20(inst431_l_next20),
    .L21(inst431_l_next21), .L22(inst431_l_next22), .L23(inst431_l_next23), .L24(inst431_l_next24),
    .L25(inst431_l_next25), .L26(inst431_l_next26), .L27(inst431_l_next27), .L28(inst431_l_next28),
    .L29(inst431_l_next29), .L30(inst431_l_next30), .L31(inst431_l_next31), .L32(inst431_l_next32),
    .clk(clk), .key(inst1_round5key), .rst_n(rst_n), .R_next1(inst44_r_next1), .R_next2(inst44_r_next2),
    .R_next3(inst44_r_next3), .R_next4(inst44_r_next4), .R_next5(inst44_r_next5), .R_next6(inst44_r_next6),
    .R_next7(inst44_r_next7), .R_next8(inst44_r_next8), .R_next9(inst44_r_next9), .R_next10(inst44_r_next10),
    .R_next11(inst44_r_next11), .R_next12(inst44_r_next12), .R_next13(inst44_r_next13),
    .R_next14(inst44_r_next14), .R_next15(inst44_r_next15), .R_next16(inst44_r_next16),
    .R_next17(inst44_r_next17), .R_next18(inst44_r_next18), .R_next19(inst44_r_next19),
    .R_next20(inst44_r_next20), .R_next21(inst44_r_next21), .R_next22(inst44_r_next22),
    .R_next23(inst44_r_next23), .R_next24(inst44_r_next24), .R_next25(inst44_r_next25),
    .R_next26(inst44_r_next26), .R_next27(inst44_r_next27), .R_next28(inst44_r_next28),
    .R_next29(inst44_r_next29), .R_next30(inst44_r_next30), .R_next31(inst44_r_next31),
    .R_next32(inst44_r_next32), .L_next1(inst44_l_next1), .L_next2(inst44_l_next2), .L_next3(inst44_l_next3),
    .L_next4(inst44_l_next4), .L_next5(inst44_l_next5), .L_next6(inst44_l_next6), .L_next7(inst44_l_next7),
    .L_next8(inst44_l_next8), .L_next9(inst44_l_next9), .L_next10(inst44_l_next10),
    .L_next11(inst44_l_next11), .L_next12(inst44_l_next12), .L_next13(inst44_l_next13),
    .L_next14(inst44_l_next14), .L_next15(inst44_l_next15), .L_next16(inst44_l_next16),
    .L_next17(inst44_l_next17), .L_next18(inst44_l_next18), .L_next19(inst44_l_next19),
    .L_next20(inst44_l_next20), .L_next21(inst44_l_next21), .L_next22(inst44_l_next22),
    .L_next23(inst44_l_next23), .L_next24(inst44_l_next24), .L_next25(inst44_l_next25),
    .L_next26(inst44_l_next26), .L_next27(inst44_l_next27), .L_next28(inst44_l_next28),
    .L_next29(inst44_l_next29), .L_next30(inst44_l_next30), .L_next31(inst44_l_next31),
    .L_next32(inst44_l_next32));
  round inst45 (
    .R1(inst44_r_next1), .R2(inst44_r_next2), .R3(inst44_r_next3), .R4(inst44_r_next4), .R5(inst44_r_next5),
    .R6(inst44_r_next6), .R7(inst44_r_next7), .R8(inst44_r_next8), .R9(inst44_r_next9),
    .R10(inst44_r_next10), .R11(inst44_r_next11), .R12(inst44_r_next12), .R13(inst44_r_next13),
    .R14(inst44_r_next14), .R15(inst44_r_next15), .R16(inst44_r_next16), .R17(inst44_r_next17),
    .R18(inst44_r_next18), .R19(inst44_r_next19), .R20(inst44_r_next20), .R21(inst44_r_next21),
    .R22(inst44_r_next22), .R23(inst44_r_next23), .R24(inst44_r_next24), .R25(inst44_r_next25),
    .R26(inst44_r_next26), .R27(inst44_r_next27), .R28(inst44_r_next28), .R29(inst44_r_next29),
    .R30(inst44_r_next30), .R31(inst44_r_next31), .R32(inst44_r_next32), .L1(inst44_l_next1),
    .L2(inst44_l_next2), .L3(inst44_l_next3), .L4(inst44_l_next4), .L5(inst44_l_next5), .L6(inst44_l_next6),
    .L7(inst44_l_next7), .L8(inst44_l_next8), .L9(inst44_l_next9), .L10(inst44_l_next10),
    .L11(inst44_l_next11), .L12(inst44_l_next12), .L13(inst44_l_next13), .L14(inst44_l_next14),
    .L15(inst44_l_next15), .L16(inst44_l_next16), .L17(inst44_l_next17), .L18(inst44_l_next18),
    .L19(inst44_l_next19), .L20(inst44_l_next20), .L21(inst44_l_next21), .L22(inst44_l_next22),
    .L23(inst44_l_next23), .L24(inst44_l_next24), .L25(inst44_l_next25), .L26(inst44_l_next26),
    .L27(inst44_l_next27), .L28(inst44_l_next28), .L29(inst44_l_next29), .L30(inst44_l_next30),
    .L31(inst44_l_next31), .L32(inst44_l_next32), .clk(clk), .key(inst1_round6key), .rst_n(rst_n),
    .R_next1(inst45_r_next1), .R_next2(inst45_r_next2), .R_next3(inst45_r_next3), .R_next4(inst45_r_next4),
    .R_next5(inst45_r_next5), .R_next6(inst45_r_next6), .R_next7(inst45_r_next7), .R_next8(inst45_r_next8),
    .R_next9(inst45_r_next9), .R_next10(inst45_r_next10), .R_next11(inst45_r_next11),
    .R_next12(inst45_r_next12), .R_next13(inst45_r_next13), .R_next14(inst45_r_next14),
    .R_next15(inst45_r_next15), .R_next16(inst45_r_next16), .R_next17(inst45_r_next17),
    .R_next18(inst45_r_next18), .R_next19(inst45_r_next19), .R_next20(inst45_r_next20),
    .R_next21(inst45_r_next21), .R_next22(inst45_r_next22), .R_next23(inst45_r_next23),
    .R_next24(inst45_r_next24), .R_next25(inst45_r_next25), .R_next26(inst45_r_next26),
    .R_next27(inst45_r_next27), .R_next28(inst45_r_next28), .R_next29(inst45_r_next29),
    .R_next30(inst45_r_next30), .R_next31(inst45_r_next31), .R_next32(inst45_r_next32),
    .L_next1(inst45_l_next1), .L_next2(inst45_l_next2), .L_next3(inst45_l_next3), .L_next4(inst45_l_next4),
    .L_next5(inst45_l_next5), .L_next6(inst45_l_next6), .L_next7(inst45_l_next7), .L_next8(inst45_l_next8),
    .L_next9(inst45_l_next9), .L_next10(inst45_l_next10), .L_next11(inst45_l_next11),
    .L_next12(inst45_l_next12), .L_next13(inst45_l_next13), .L_next14(inst45_l_next14),
    .L_next15(inst45_l_next15), .L_next16(inst45_l_next16), .L_next17(inst45_l_next17),
    .L_next18(inst45_l_next18), .L_next19(inst45_l_next19), .L_next20(inst45_l_next20),
    .L_next21(inst45_l_next21), .L_next22(inst45_l_next22), .L_next23(inst45_l_next23),
    .L_next24(inst45_l_next24), .L_next25(inst45_l_next25), .L_next26(inst45_l_next26),
    .L_next27(inst45_l_next27), .L_next28(inst45_l_next28), .L_next29(inst45_l_next29),
    .L_next30(inst45_l_next30), .L_next31(inst45_l_next31), .L_next32(inst45_l_next32));
  round inst46 (
    .R1(inst45_r_next1), .R2(inst45_r_next2), .R3(inst45_r_next3), .R4(inst45_r_next4), .R5(inst45_r_next5),
    .R6(inst45_r_next6), .R7(inst45_r_next7), .R8(inst45_r_next8), .R9(inst45_r_next9),
    .R10(inst45_r_next10), .R11(inst45_r_next11), .R12(inst45_r_next12), .R13(inst45_r_next13),
    .R14(inst45_r_next14), .R15(inst45_r_next15), .R16(inst45_r_next16), .R17(inst45_r_next17),
    .R18(inst45_r_next18), .R19(inst45_r_next19), .R20(inst45_r_next20), .R21(inst45_r_next21),
    .R22(inst45_r_next22), .R23(inst45_r_next23), .R24(inst45_r_next24), .R25(inst45_r_next25),
    .R26(inst45_r_next26), .R27(inst45_r_next27), .R28(inst45_r_next28), .R29(inst45_r_next29),
    .R30(inst45_r_next30), .R31(inst45_r_next31), .R32(inst45_r_next32), .L1(inst45_l_next1),
    .L2(inst45_l_next2), .L3(inst45_l_next3), .L4(inst45_l_next4), .L5(inst45_l_next5), .L6(inst45_l_next6),
    .L7(inst45_l_next7), .L8(inst45_l_next8), .L9(inst45_l_next9), .L10(inst45_l_next10),
    .L11(inst45_l_next11), .L12(inst45_l_next12), .L13(inst45_l_next13), .L14(inst45_l_next14),
    .L15(inst45_l_next15), .L16(inst45_l_next16), .L17(inst45_l_next17), .L18(inst45_l_next18),
    .L19(inst45_l_next19), .L20(inst45_l_next20), .L21(inst45_l_next21), .L22(inst45_l_next22),
    .L23(inst45_l_next23), .L24(inst45_l_next24), .L25(inst45_l_next25), .L26(inst45_l_next26),
    .L27(inst45_l_next27), .L28(inst45_l_next28), .L29(inst45_l_next29), .L30(inst45_l_next30),
    .L31(inst45_l_next31), .L32(inst45_l_next32), .clk(clk), .key(inst1_round7key), .rst_n(rst_n),
    .R_next1(inst46_r_next1), .R_next2(inst46_r_next2), .R_next3(inst46_r_next3), .R_next4(inst46_r_next4),
    .R_next5(inst46_r_next5), .R_next6(inst46_r_next6), .R_next7(inst46_r_next7), .R_next8(inst46_r_next8),
    .R_next9(inst46_r_next9), .R_next10(inst46_r_next10), .R_next11(inst46_r_next11),
    .R_next12(inst46_r_next12), .R_next13(inst46_r_next13), .R_next14(inst46_r_next14),
    .R_next15(inst46_r_next15), .R_next16(inst46_r_next16), .R_next17(inst46_r_next17),
    .R_next18(inst46_r_next18), .R_next19(inst46_r_next19), .R_next20(inst46_r_next20),
    .R_next21(inst46_r_next21), .R_next22(inst46_r_next22), .R_next23(inst46_r_next23),
    .R_next24(inst46_r_next24), .R_next25(inst46_r_next25), .R_next26(inst46_r_next26),
    .R_next27(inst46_r_next27), .R_next28(inst46_r_next28), .R_next29(inst46_r_next29),
    .R_next30(inst46_r_next30), .R_next31(inst46_r_next31), .R_next32(inst46_r_next32),
    .L_next1(inst46_l_next1), .L_next2(inst46_l_next2), .L_next3(inst46_l_next3), .L_next4(inst46_l_next4),
    .L_next5(inst46_l_next5), .L_next6(inst46_l_next6), .L_next7(inst46_l_next7), .L_next8(inst46_l_next8),
    .L_next9(inst46_l_next9), .L_next10(inst46_l_next10), .L_next11(inst46_l_next11),
    .L_next12(inst46_l_next12), .L_next13(inst46_l_next13), .L_next14(inst46_l_next14),
    .L_next15(inst46_l_next15), .L_next16(inst46_l_next16), .L_next17(inst46_l_next17),
    .L_next18(inst46_l_next18), .L_next19(inst46_l_next19), .L_next20(inst46_l_next20),
    .L_next21(inst46_l_next21), .L_next22(inst46_l_next22), .L_next23(inst46_l_next23),
    .L_next24(inst46_l_next24), .L_next25(inst46_l_next25), .L_next26(inst46_l_next26),
    .L_next27(inst46_l_next27), .L_next28(inst46_l_next28), .L_next29(inst46_l_next29),
    .L_next30(inst46_l_next30), .L_next31(inst46_l_next31), .L_next32(inst46_l_next32));
